# EAGLE design TSL25911-Breakout_v10 (EAGLE 7.5.0)
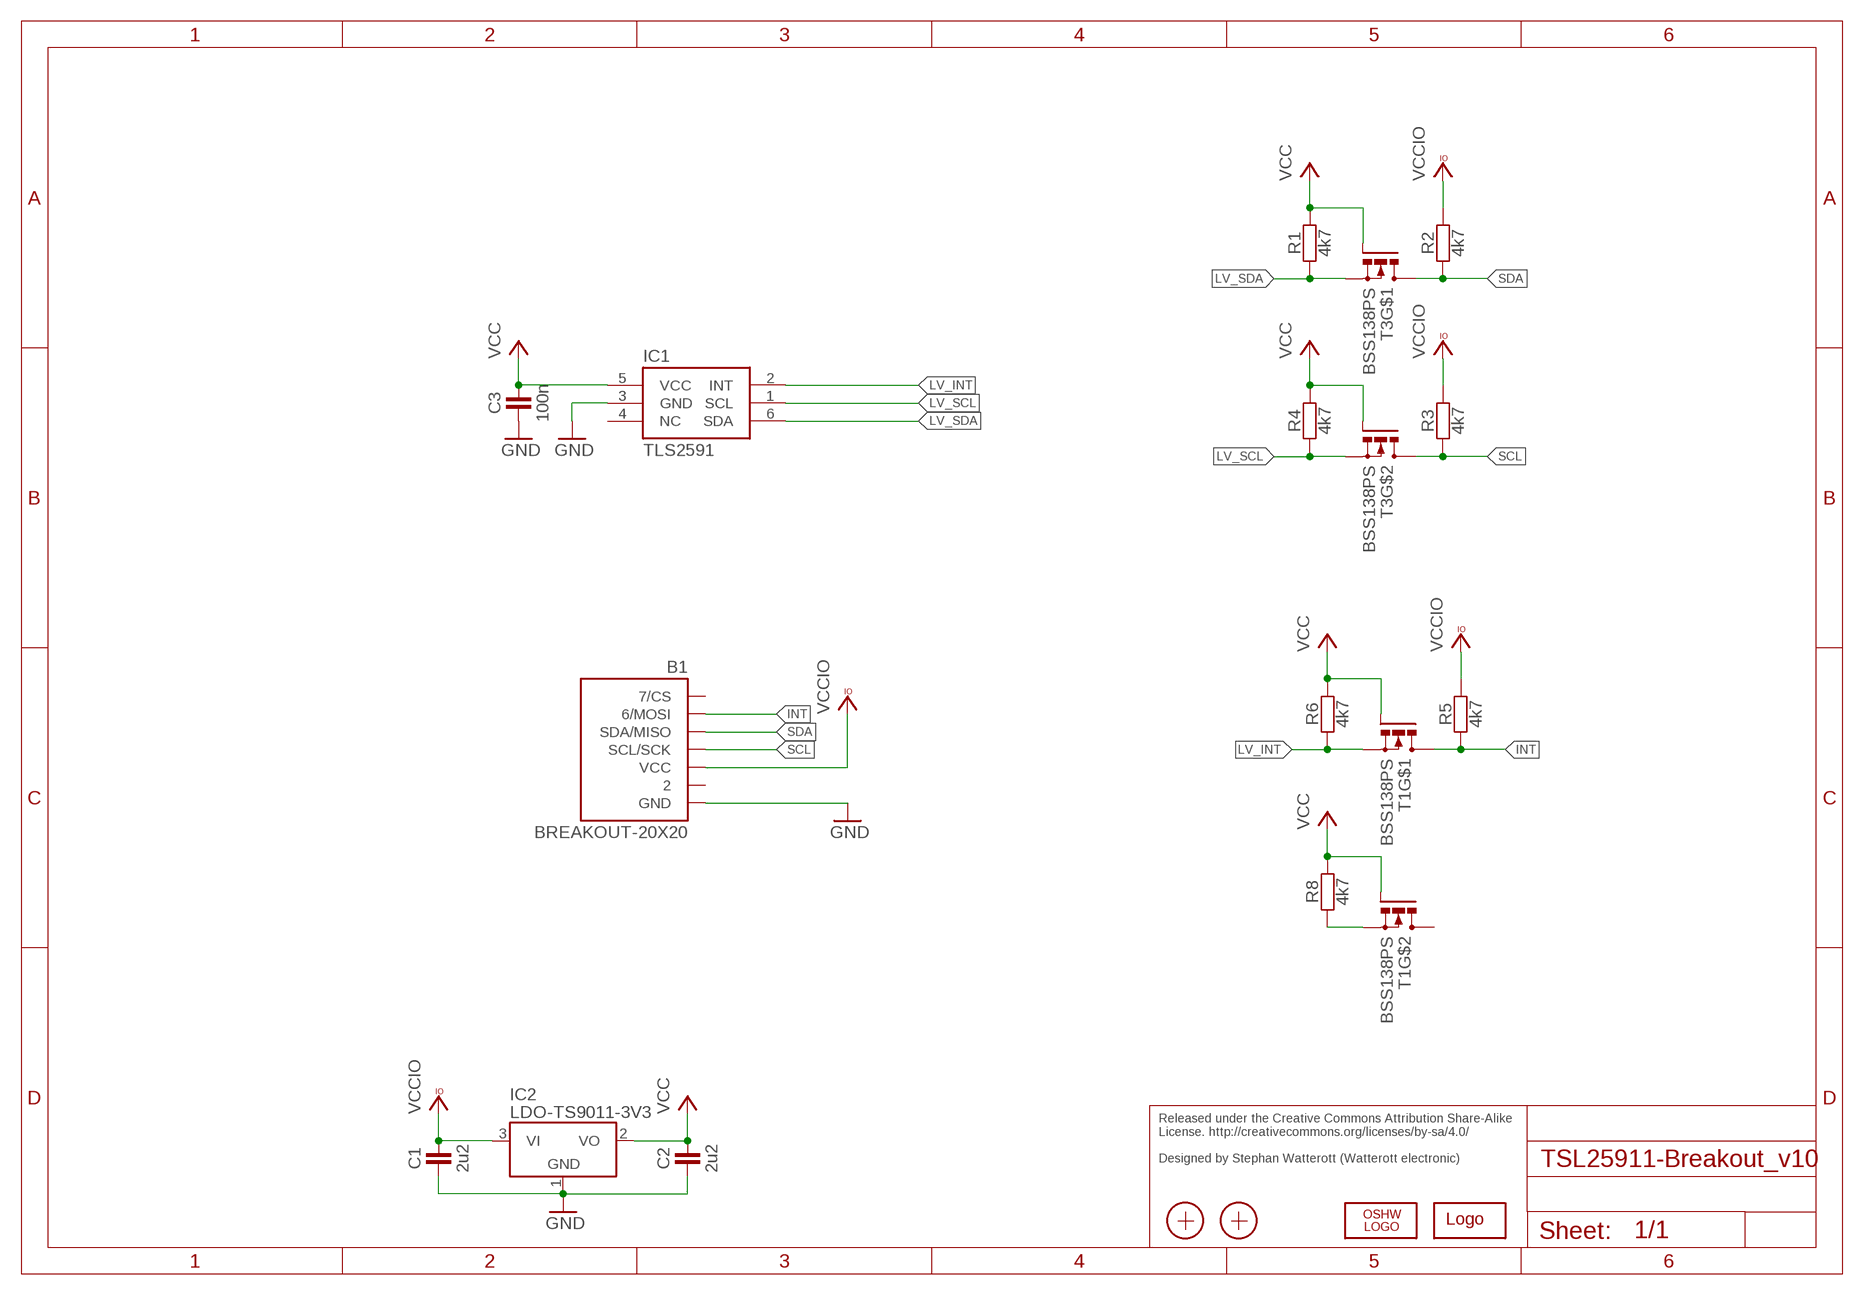
[diagram p0: schematic, sheet 1]

## Parts
B1  BREAKOUT-20X20  [BREAKOUT-20X20]
C1  2u2  CAPACITOR-C0402  [R0402]
C2  2u2  CAPACITOR-C0402  [R0402]
C3  100n  CAPACITOR-C0402  [R0402]
IC1  TLS2591  [WFDFN6]
IC2  LDO-TS9011-3V3  [SOT23]
LOGO1  LOGO-S_PLACE_M  [SPARK_TPLACE_M]
LOGO2  OSHW_LOGOX0070  [OSHW_6X70]
R1  4k7  RESISTOR-R0402  [R0402]
R2  4k7  RESISTOR-R0402  [R0402]
R3  4k7  RESISTOR-R0402  [R0402]
R4  4k7  RESISTOR-R0402  [R0402]
R5  4k7  RESISTOR-R0402  [R0402]
R6  4k7  RESISTOR-R0402  [R0402]
R8  4k7  RESISTOR-R0402  [R0402]
T1  BSS138PS  [SOT363]
T3  BSS138PS  [SOT363]
X1  PASSER-07  [PASSER_07MM]
X2  PASSER-07  [PASSER_07MM]

## Nets
GND: B1.GND C1.1 C2.1 C3.1 IC1.3(GND) IC2.1(GND)
INT: B1.MOSI(6/MOSI) R5.1 T1.6(D)
LV_CSB: R8.1 T1.4(S)
LV_INT: IC1.2(INT) R6.1 T1.1(S)
LV_SCL: IC1.1(SCL) R4.1 T3.4(S)
LV_SDA: IC1.6(SDA) R1.1 T3.1(S)
SCL: B1.SCL/SCK R3.1 T3.3(D)
SDA: B1.SDA/MISO R2.1 T3.6(D)
VCC: C2.2 C3.2 IC1.5(VCC) IC2.2(VO) R1.2 R4.2 R6.2 R8.2 T1.2(G) T1.5(G) T3.2(G) T3.5(G)
VCCIO: B1.VCC C1.2 IC2.3(VI) R2.2 R3.2 R5.2
Unconnected: B1.2 B1.CS(7/CS) IC1.4(NC) T1.3(D)

## Notes on the sheet
- Released under the Creative Commons Attribution Share-Alike 
  License. http://creativecommons.org/licenses/by-sa/4.0/
  
  Designed by Stephan Watterott (Watterott electronic)

## Library data of the parts
B1 = we-board:BREAKOUT: Breakout Template
C1-C3 = we-rcl:CAPACITOR: Capacitors ...4.7uF @ 6.3V -> 0402 ...10uF @ 16V -> 0603 ...22uF @ 25V -> 0805
IC1 = we-sensor:TLS2591: AMS TSL2591 light-to-digital converter
IC2 = we-power:LDO: LDOs TS1117 800mA, Vin max 12V TS9011 250mA, Vin max 12V - compatible AP2210 300mA, Vin max 15V TS5204 150mA, Vin max 16V
LOGO1 = we-symbol:LOGO
LOGO2 = we-symbol:OSHW_LOGO
R1-R6 R8 = we-rcl:RESISTOR: Resistors all kinds in 0603 and 0402
T1 T3 = we-transistor:BSS138PS
X1 X2 = we-symbol:PASSER

## Board
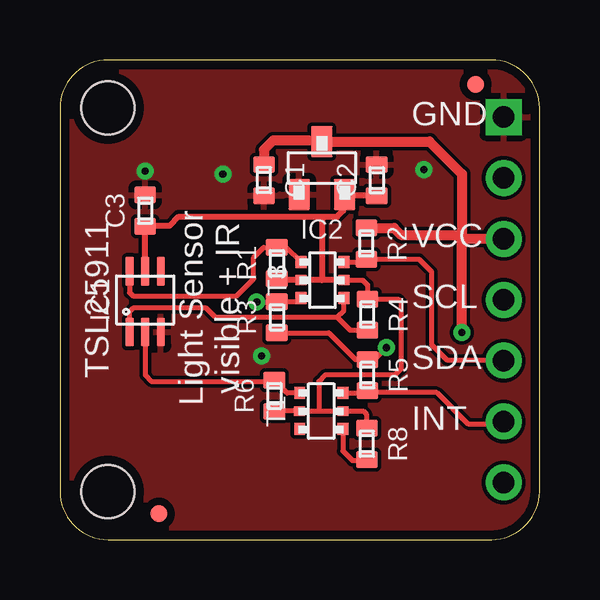
[diagram p1: board, top side]
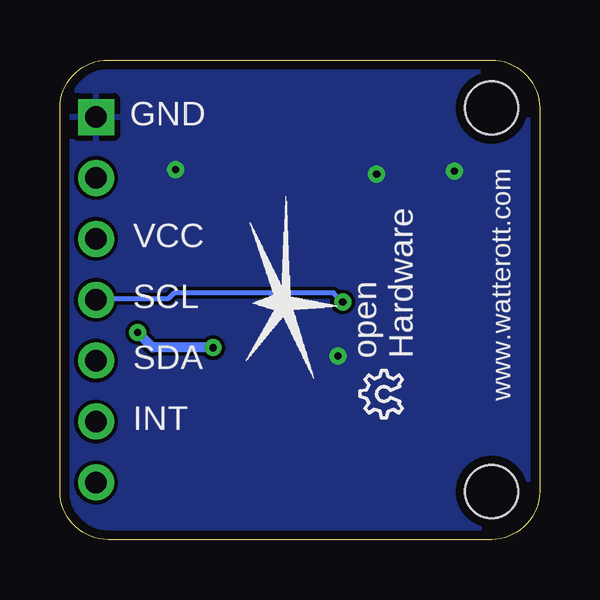
[diagram p2: board, bottom side, seen from below]

Size 20 x 20 mm. Coordinates in mm from the lower left corner, seen from the top.
Copper layers (1*16): Top 0.035mm / dielectric 1.5mm / Bottom 0.035mm
Design rules "default *": minimum track width 6mil, minimum drill 0.296mm, track to track 6mil, track to pad 6mil, pad to pad 6mil, via to via 6mil, smd to smd 1mil, copper to edge 15mil, drill to drill 8mil, minimum pad ring 10mil, minimum via ring 8mil, stop-mask expansion 4mil, vias tented up to drill 0.8mm, thermal gap 10mil

### Footprints (pad centres in the part's own frame; a part is rotated, then mirrored left to right if it is on the bottom)
BREAKOUT-20X20 = drill 0.9 pad 1.5: 2 18.5,15.08; CS 18.5,2.38; MOSI 18.5,4.92; SCL/SCK 18.5,10; SDA/MISO 18.5,7.46; VCC 18.5,12.54 | drill 0.9 pad 1.5 square: GND 18.5,17.62 | hole 2.2: 2,18; 2,2
R0402 = smd 0.9 x 0.7: 1 0,0.65; 2 0,-0.65
WFDFN6 = smd 1.2 x 0.35: 1 -1.35,0.65; 2 -1.35,0; 3 -1.35,-0.65; 4 1.19,-0.65; 5 1.19,0; 6 1.19,0.65
SOT23 = smd 1.3 x 0.9: 1 -1.1,0.95; 2 -1.1,-0.95; 3 1.1,0
SOT363 = smd 0.5 x 0.5: 1 -0.9,0.75; 3 -0.9,-0.75; 4 0.9,-0.75; 6 0.9,0.75 | smd 0.5 x 0.4: 2 -0.9,0; 5 0.9,0
PASSER_07MM = smd 0.7 x 0.7: X 0,0

### Placement (x,y rotation side)
B1  0,0 0 top
C1  8.51,14.99 180 top
C2  13.21,14.99 0 top
C3  3.56,13.72 0 top
IC1  3.56,10 90 top
IC2  10.92,15.49 90 top
LOGO1  10.67,9.91 90 bottom
LOGO2  5.71,5.08 90 bottom
R1  9.04,11.53 0 top
R2  12.78,12.34 180 top
R3  9.04,9.27 0 top
R4  12.83,9.37 180 top
R5  12.83,6.86 180 top
R6  8.94,5.99 0 top
R8  12.8,3.99 180 top
T1  10.9,5.36 0 top
T3  10.95,10.82 0 top
X1  17.34,18.99 0 top
X2  4.13,1.08 0 top

### Tracks (layer width: path | path; a pad name or v marks a point on that pad's centre or on a via)
GND  (via drill 0.3)
  other vias: 3.56,15.37 8.41,7.66 6.79,15.24 15.18,15.43
  pour Top: 0,20 20,20 20,0 0,0
  pour Bottom: 0,20 20,20 20,0 0,0
INT
  Top 0.2: 12.75,6.11 R5.1 | T1.6 12.73,6.11 R5.1 | R5.1 12.9,6.13 15.71,6.13 17.02,4.83 18.41,4.83 B1.MOSI
LV_CSB
  Top 0.2: T1.4 11.8,3.7 12.19,3.3 12.77,3.3 R8.1
LV_INT
  Top 0.2: T1.1 9.48,6.11 R6.1 8.9,6.6 3.81,6.6 3.56,6.86 IC1.2
LV_SCL
  Top 0.2: 11.56,9.27 6.48,9.27 6.1,9.65 3.05,9.65 2.91,9.51 IC1.1 | 11.56,9.27 11.84,9.55 11.84,10.06 T3.4 | R4.1 12.11,8.72 11.56,9.27
LV_SDA
  Top 0.2: T3.1 9.44,12.18 R1.1 8.5,12.18 8.08,11.76 8.08,10.87 7.37,10.16 3.05,10.16 2.91,10.3 IC1.6
SCL  (via drill 0.3)
  Top 0.2: T3.3 9.9,9.92 R3.1 9.03,9.91 v8.2,9.91
  Bottom 0.2: v8.2,9.91 8.59,10.29 15.24,10.29 15.49,10.03 18.47,10.03 B1.SCL/SCK
SDA
  Top 0.2: T3.6 12.65,11.57 R2.1 14.98,11.69 15.49,11.18 15.49,8.13 16.13,7.49 18.47,7.49 B1.SDA/MISO
VCC
  Top 0.2: T3.5 12.62,10.82 12.83,10.62 R4.2 14.11,10.02 14.22,9.91 14.22,7.11 13.97,6.86 11.05,6.86 10.79,6.6 10.79,5.36 | R6.2 8.96,5.36 T1.2 10.79,5.36 | 10.79,5.36 T1.5 12.65,5.36 12.78,5.23 12.78,4.66 R8.2
  Top 0.254: 3.56,12.84 C3.2 | T3.5 10.92,10.82 | 10.92,10.82 T3.2 9.1,10.82 R1.2 | 10.92,13.46 4.95,13.46 4.57,13.08 3.57,13.08 C3.2 | 11.8,14.34 IC2.2 | 10.92,13.46 10.92,10.82 | IC1.5 C3.2 | 10.92,13.46 11.56,13.46 11.81,13.72 11.81,14.33 IC2.2 | C2.2 11.93,14.34 IC2.2
VCCIO  (via drill 0.3)
  Top 0.2: R3.2 11.22,8.62 12.33,7.51 R5.2 13.12,7.51 v13.61,8 13.69,8
  Top 0.406: C1.2 8.51,16.26 8.89,16.64 10.37,16.64 IC2.3 15.41,16.59 16.76,15.24 16.76,12.7 | R2.2 13.93,12.99 14.22,12.7 16.76,12.7 | v16.76,8.64 16.76,12.45 | 16.76,12.45 16.76,12.7 | B1.VCC 16.86,12.54 16.76,12.45
  Bottom 0.2: 13.72,7.9 v13.61,8
  Bottom 0.406: v13.61,8 16.13,8 v16.76,8.64

### Text on the board
tPlace: GND | VCC | TSL25911 | Light Sensor / visible + IR | SCL | SDA | INT
bPlace: GND | www.watterott.com | VCC | SCL | open / Hardware | SDA | INT